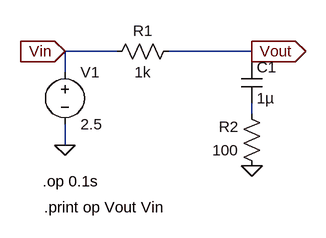
[diagram p0: schematic Prob_1a.asc]
Prob_1a.asc, the LTspice schematic file:
Version 4
SHEET 1 880 680
WIRE 192 48 112 48
WIRE 400 48 272 48
WIRE 400 64 400 48
WIRE 112 80 112 48
WIRE 400 144 400 128
WIRE 112 192 112 160
FLAG 112 192 0
FLAG 400 224 0
FLAG 112 48 Vin
IOPIN 112 48 In
FLAG 400 48 Vout
IOPIN 400 48 Out
SYMBOL voltage 112 64 R0
WINDOW 123 0 0 Left 0
WINDOW 39 0 0 Left 0
SYMATTR InstName V1
SYMATTR Value 2.5
SYMBOL res 288 32 R90
WINDOW 0 0 56 VBottom 2
WINDOW 3 32 56 VTop 2
SYMATTR InstName R1
SYMATTR Value 1k
SYMBOL res 416 240 R180
WINDOW 0 36 76 Left 2
WINDOW 3 36 40 Left 2
SYMATTR InstName R2
SYMATTR Value 100
SYMBOL cap 384 64 R0
SYMATTR InstName C1
SYMATTR Value 1µ
TEXT 78 248 Left 2 !.op 0.1s
TEXT 80 288 Left 2 !.print op Vout Vin

The netlist it stands for:
* Prob_1a.asc
V1 Vin 0 2.5
R1 Vout Vin 1k
R2 0 N001 100
C1 Vout N001 1µ
.op 0.1s
.print op Vout Vin
.backanno
.end